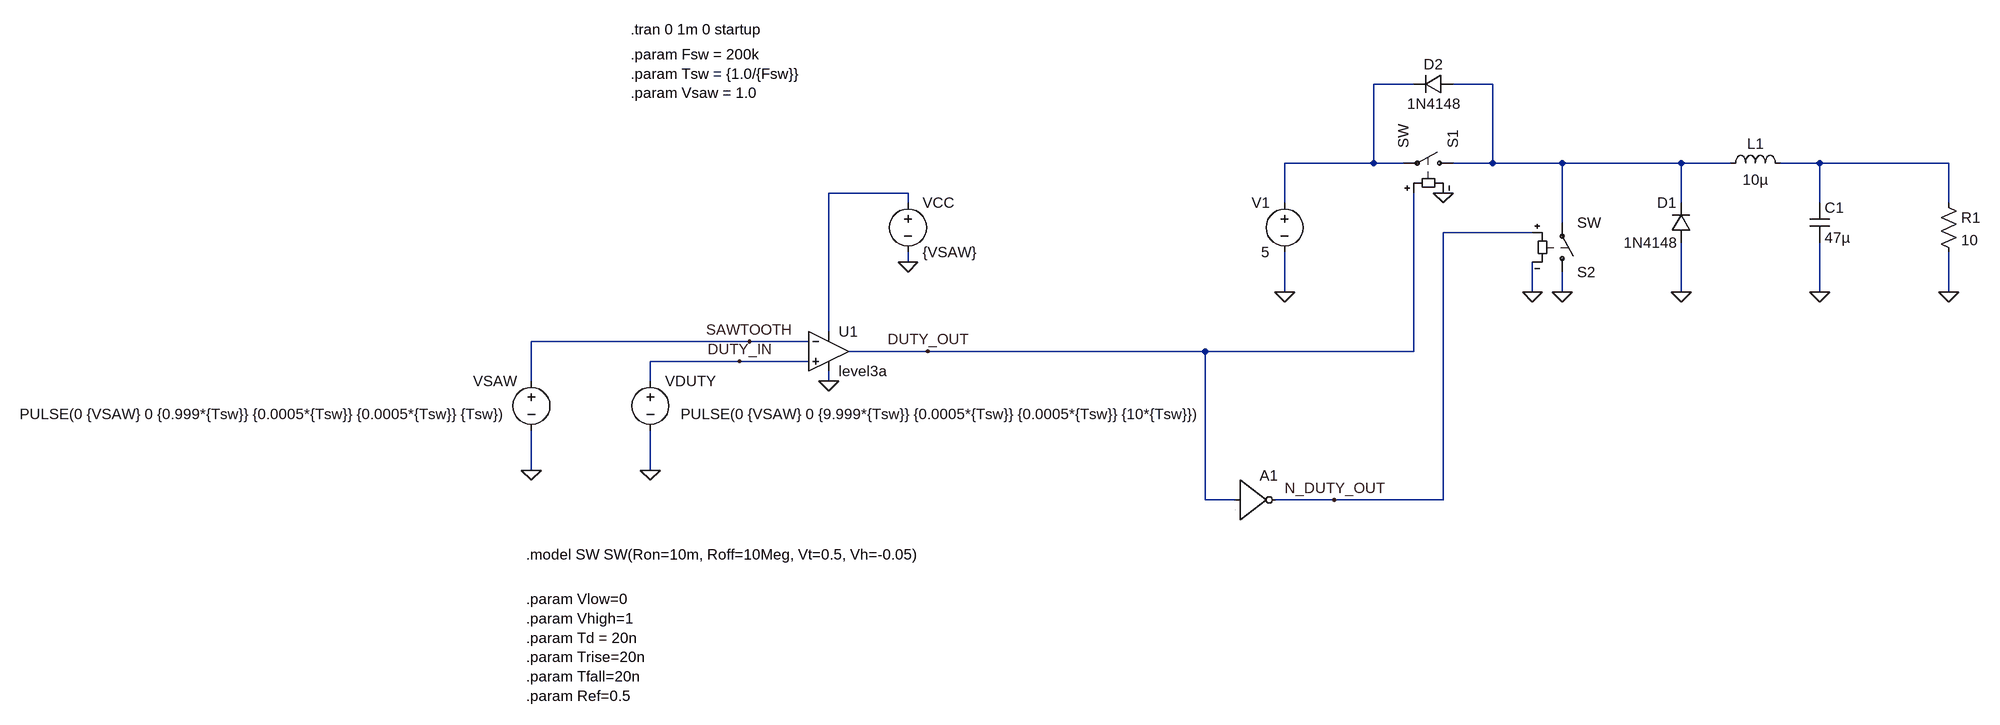
[diagram p0: schematic Duty_Cycle_Simulator.asc]
Duty_Cycle_Simulator.asc, the LTspice schematic file:
Version 4.1
SHEET 1 2692 940
WIRE 1424 -48 1360 -48
WIRE 1552 -48 1488 -48
WIRE 1360 80 1360 -48
WIRE 1360 80 1216 80
WIRE 1408 80 1360 80
WIRE 1552 80 1552 -48
WIRE 1552 80 1488 80
WIRE 1664 80 1552 80
WIRE 1856 80 1664 80
WIRE 1936 80 1856 80
WIRE 2080 80 2016 80
WIRE 2288 80 2080 80
WIRE 608 128 480 128
WIRE 608 144 608 128
WIRE 1216 144 1216 80
WIRE 1856 144 1856 80
WIRE 2080 144 2080 80
WIRE 2288 144 2288 80
WIRE 1664 176 1664 80
WIRE 1616 192 1472 192
WIRE 608 240 608 224
WIRE 1216 288 1216 224
WIRE 1616 288 1616 240
WIRE 1664 288 1664 256
WIRE 1856 288 1856 208
WIRE 2080 288 2080 208
WIRE 2288 288 2288 224
WIRE 480 352 480 128
WIRE 352 368 0 368
WIRE 448 368 352 368
WIRE 640 384 512 384
WIRE 1088 384 640 384
WIRE 1424 384 1424 128
WIRE 1424 384 1088 384
WIRE 336 400 192 400
WIRE 448 400 336 400
WIRE 0 432 0 368
WIRE 192 432 192 400
WIRE 480 432 480 416
WIRE 0 576 0 512
WIRE 192 576 192 512
WIRE 1088 624 1088 384
WIRE 1136 624 1088 624
WIRE 1296 624 1200 624
WIRE 1472 624 1472 192
WIRE 1472 624 1296 624
FLAG 0 576 0
FLAG 480 432 0
FLAG 608 240 0
FLAG 192 576 0
FLAG 352 368 SAWTOOTH
FLAG 336 400 DUTY_IN
FLAG 640 384 DUTY_OUT
FLAG 1296 624 N_DUTY_OUT
FLAG 2288 288 0
FLAG 1216 288 0
FLAG 1664 288 0
FLAG 1616 288 0
FLAG 1472 128 0
FLAG 2080 288 0
FLAG 1856 288 0
SYMBOL voltage 0 416 M0
WINDOW 3 49 69 Left 2
WINDOW 123 0 0 Left 0
WINDOW 39 0 0 Left 0
SYMATTR InstName VSAW
SYMATTR Value PULSE(0 {VSAW} 0 {0.999*{Tsw}} {0.0005*{Tsw}} {0.0005*{Tsw}} {Tsw})
SYMBOL voltage 608 128 R0
SYMATTR InstName VCC
SYMATTR Value {VSAW}
SYMBOL OpAmps\\UniversalOpAmp3 480 384 R0
SYMATTR InstName U1
SYMATTR Value2 Avol=1Meg GBW=100Meg Slew=100Meg
SYMBOL voltage 192 416 R0
WINDOW 3 49 69 Left 2
WINDOW 123 0 0 Left 0
WINDOW 39 0 0 Left 0
SYMATTR InstName VDUTY
SYMATTR Value PULSE(0 {VSAW} 0 {9.999*{Tsw}} {0.0005*{Tsw}} {0.0005*{Tsw}} {10*{Tsw}})
SYMBOL sw 1504 80 M270
SYMATTR InstName S1
SYMBOL Digital\\inv 1136 560 R0
WINDOW 3 8 104 Invisible 2
SYMATTR InstName A1
SYMATTR Value Vlow={Vlow}, Vhigh={Vhigh}, Td={Td}, Trise={Trise}, Tfall={Tfall}, Ref={Ref}
SYMBOL sw 1664 272 M180
SYMATTR InstName S2
SYMBOL voltage 1216 128 M0
WINDOW 123 0 0 Left 0
WINDOW 39 0 0 Left 0
SYMATTR InstName V1
SYMATTR Value 5
SYMBOL res 2272 128 R0
SYMATTR InstName R1
SYMATTR Value 10
SYMBOL ind 1920 96 R270
WINDOW 0 32 56 VTop 2
WINDOW 3 5 56 VBottom 2
SYMATTR InstName L1
SYMATTR Value 10µ
SYMBOL cap 2064 144 R0
SYMATTR InstName C1
SYMATTR Value 47µ
SYMBOL diode 1872 208 R180
WINDOW 0 24 64 Left 2
WINDOW 3 24 0 Left 2
SYMATTR InstName D1
SYMATTR Value 1N4148
SYMBOL diode 1488 -32 M270
WINDOW 0 32 32 VTop 2
WINDOW 3 0 32 VBottom 2
SYMATTR InstName D2
SYMATTR Value 1N4148
TEXT 160 -96 Left 2 !.param Fsw = 200k\n.param Tsw = {1.0/{Fsw}}\n.param Vsaw = 1.0
TEXT 160 -136 Left 2 !.tran 0 1m 0 startup
TEXT -8 712 Left 2 !.model SW SW(Ron=10m, Roff=10Meg, Vt=0.5, Vh=-0.05)
TEXT -8 784 Left 2 !.param Vlow=0\n.param Vhigh=1\n.param Td = 20n\n.param Trise=20n\n.param Tfall=20n\n.param Ref=0.5

The netlist it stands for:
* Duty_Cycle_Simulator.asc
VSAW SAWTOOTH 0 PULSE(0 {VSAW} 0 {0.999*{Tsw}} {0.0005*{Tsw}} {0.0005*{Tsw}} {Tsw})
VCC N004 0 {VSAW}
X§U1 DUTY_IN SAWTOOTH N004 0 DUTY_OUT level3a Avol=1Meg GBW=100Meg Slew=100Meg Ilimit=25m Rail=0 Vos=0 Phimargin=45 En=0 Enk=0 In=0 Ink=0 Rin=500Meg  ; pins In+ In- V+ V- OUT
VDUTY DUTY_IN 0 PULSE(0 {VSAW} 0 {9.999*{Tsw}} {0.0005*{Tsw}} {0.0005*{Tsw}} {10*{Tsw}})
S1 N002 N001 DUTY_OUT 0 SW
A1 DUTY_OUT 0 0 0 0 N_DUTY_OUT 0 0 BUF Vlow={Vlow}, Vhigh={Vhigh}, Td={Td}, Trise={Trise}, Tfall={Tfall}, Ref={Ref}
S2 0 N002 N_DUTY_OUT 0 SW
V1 N001 0 5
R1 N003 0 10
L1 N002 N003 10µ
C1 N003 0 47µ
D1 0 N002 1N4148
D2 N002 N001 1N4148
.model D D
.lib standard.dio
.param Fsw = 200k
.param Tsw = {1.0/{Fsw}}
.param Vsaw = 1.0
.tran 0 1m 0 startup
.model SW SW(Ron=10m, Roff=10Meg, Vt=0.5, Vh=-0.05)
.param Vlow=0
.param Vhigh=1
.param Td = 20n
.param Trise=20n
.param Tfall=20n
.param Ref=0.5
.backanno
.end